# Altium schematic sheet Micro.SchDoc
size A
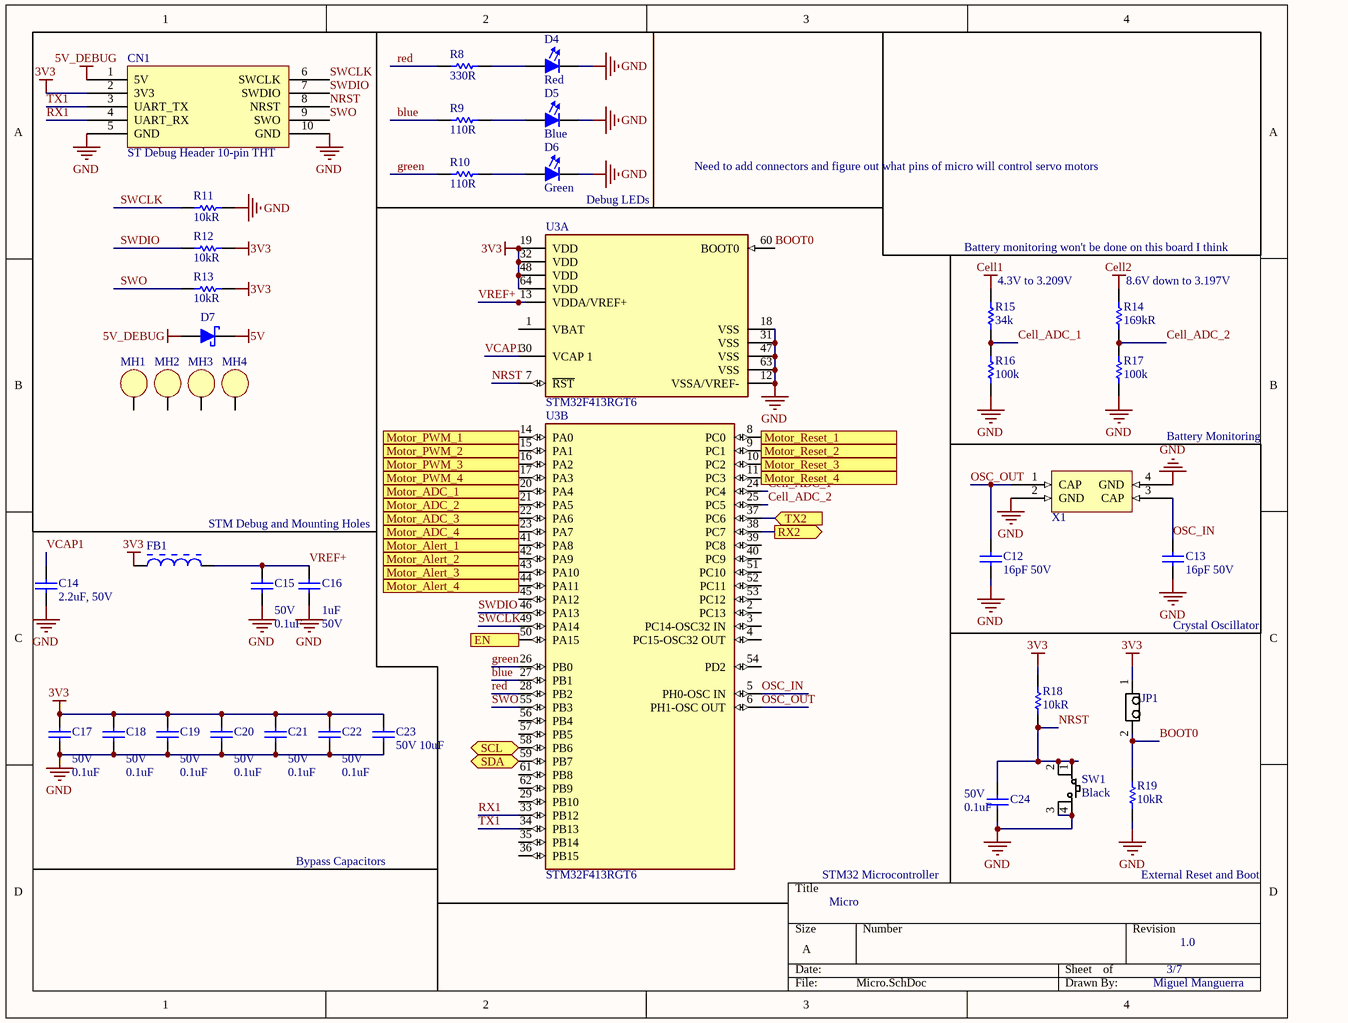
[diagram p0: Micro.SchDoc]

## Parts
C12  Voltage: 16pF 50V  [CAPC1608X90X35ML10T15]  (hidden comment: 16pF Ceramic 50V 5% 0603)
C13  Voltage: 16pF 50V  [CAPC1608X90X35ML10T15]  (hidden comment: 16pF Ceramic 50V 5% 0603)
C14  2.2uF, 50V  [CAPC1608N(0603")]
C15  Voltage: 50V  Capacitance: 0.1uF  [FP-CL10-0_1-MFG]  (hidden comment: CL10B104JB8NNNC)
C16  Capacitance: 1uF  Voltage: 50V  [0803 CAP]  (hidden comment: CL21B105KBFNNNG)
C17  Voltage: 50V  Capacitance: 0.1uF  [FP-CL10-0_1-MFG]  (hidden comment: CL10B104JB8NNNC)
C18  Voltage: 50V  Capacitance: 0.1uF  [FP-CL10-0_1-MFG]  (hidden comment: CL10B104JB8NNNC)
C19  Voltage: 50V  Capacitance: 0.1uF  [FP-CL10-0_1-MFG]  (hidden comment: CL10B104JB8NNNC)
C20  Voltage: 50V  Capacitance: 0.1uF  [FP-CL10-0_1-MFG]  (hidden comment: CL10B104JB8NNNC)
C21  Voltage: 50V  Capacitance: 0.1uF  [FP-CL10-0_1-MFG]  (hidden comment: CL10B104JB8NNNC)
C22  Voltage: 50V  Capacitance: 0.1uF  [FP-CL10-0_1-MFG]  (hidden comment: CL10B104JB8NNNC)
C23  50V 10uF  [CAPC3216X180X50LL20T30]
C24  Voltage: 50V  Capacitance: 0.1uF  [FP-CL10-0_1-MFG]  (hidden comment: CL10B104JB8NNNC)
CN1  ST Debug Header 10-pin THT  [10-pin shrouded header THT]
D4  Red  [FP-LB_Q39E-MFG]
D5  Blue  [FP-LB_Q39E-MFG]
D6  Green  [FP-LB_Q39E-MFG]
D7  CUS08F30,H3F  [SC-76]  (value not drawn)
FB1  BLM18AG601SN1D  [MURA-BLM18-F-H1-CHIP-2_V]  (value not drawn)
JP1  1x2 Male Header  [2X1 Males Header]  (value not drawn)
MH1  Mount_Hole_3mm  [Mount-Hole_3mm]  (value not drawn)
MH2  Mount_Hole_3mm  [Mount-Hole_3mm]  (value not drawn)
MH3  Mount_Hole_3mm  [Mount-Hole_3mm]  (value not drawn)
MH4  Mount_Hole_3mm  [Mount-Hole_3mm]  (value not drawn)
R8  Resistance: 330R  [FP-CRCW0603-e3-IPC_C]  (hidden comment: CRCW0603330RFKEA)
R9  Resistance: 110R  [RESC1608X55X25ML10T15]  (hidden comment: RC0603FR-07110RL)
R10  Resistance: 110R  [RESC1608X55X25ML10T15]  (hidden comment: RC0603FR-07110RL)
R11  10kR  [RESC1608N(0603")]
R12  10kR  [RESC1608N(0603")]
R13  10kR  [RESC1608N(0603")]
R14  Resistance: 169kR  [RESC0603(1608)_M]  (hidden comment: 169kR, 1%, 1/10W, 0603)
R15  Resistance: 34k  [RESC1608N(0603")]  (hidden comment: 34kR, 1%, 1/10W, 0603)
R16  value 100k  [RESC1608N(0603")]  (hidden comment: 100kR, 1%, 1/10W, 0603 SMD)
R17  value 100k  [RESC1608N(0603")]  (hidden comment: 100kR, 1%, 1/10W, 0603 SMD)
R18  10kR  [RESC1608N(0603")]
R19  10kR  [RESC1608N(0603")]
SW1  Button Colour: Black  [4-SPST-NO]  (hidden comment: PTS645SL43SMTR92LFS)
U3  STM32F413RGT6  [FP-LQFP64-5W-MFG]  (parts A,B of 2)
X1  CRYSTAL 8.0MHZ 16PF SMD  [QFN250P750X520X140_HS-5M]  (value not drawn)

## Blocks framed on the sheet
STM Debug and Mounting Holes: CN1 D7 MH1-MH4 R11-R13
Debug LEDs: D4-D6 R8-R10

## Ports
EN (out), Motor_ADC_1 (in), Motor_ADC_2 (in), Motor_ADC_3 (in), Motor_ADC_4 (in), Motor_Alert_1 (in), Motor_Alert_2 (in), Motor_Alert_3 (in), Motor_Alert_4 (in), Motor_PWM_1 (out), Motor_PWM_2 (out), Motor_PWM_3 (out), Motor_PWM_4 (out), Motor_Reset_1, Motor_Reset_2, Motor_Reset_3, Motor_Reset_4, RX2 (out), SCL (bidir), SDA (bidir), TX2 (in)

## Nets
3V3: C17.1 C18.1 C19.1 C20.1 C21.1 C22.1 C23.1 CN1.2(3V3) FB1.1 JP1.1 R12.1 R13.1 R18.1 U3.19(VDD) U3.32(VDD) U3.48(VDD) U3.64(VDD)
5V: D7.K(Cathode)
5V_DEBUG: CN1.1(5V) D7.A(Anode)
Cell1: R15.2
Cell2: R14.2
GND: C12.1 C13.1 C14.2(Cathode) C15.2 C16.2 C17.2 C18.2 C19.2 C20.2 C21.2 C22.2 C23.2 C24.2 CN1.5(GND) CN1.10(GND) D4.1(Cathode) D5.1(Cathode) D6.1(Cathode) R11.1 R16.1 R17.1 R19.2 SW1.3 SW1.4 U3.12(VSSA/VREF-) U3.18(VSS) U3.31(VSS) U3.47(VSS) U3.63(VSS) X1.2(GND) X1.4(GND)
blue: R9.1 U3.27(PB1)
BOOT0: JP1.2 R19.1 U3.60(BOOT0)
Cell_ADC_1: R15.1 R16.2 U3.24(PC4)
Cell_ADC_2: R14.1 R17.2 U3.25(PC5)
EN: U3.50(PA15) ; port EN
green: R10.1 U3.26(PB0)
Motor_ADC_1: U3.20(PA4) ; port Motor_ADC_1
Motor_ADC_2: U3.21(PA5) ; port Motor_ADC_2
Motor_ADC_3: U3.22(PA6) ; port Motor_ADC_3
Motor_ADC_4: U3.23(PA7) ; port Motor_ADC_4
Motor_Alert_1: U3.41(PA8) ; port Motor_Alert_1
Motor_Alert_2: U3.42(PA9) ; port Motor_Alert_2
Motor_Alert_3: U3.43(PA10) ; port Motor_Alert_3
Motor_Alert_4: U3.44(PA11) ; port Motor_Alert_4
Motor_PWM_1: U3.14(PA0) ; port Motor_PWM_1
Motor_PWM_2: U3.15(PA1) ; port Motor_PWM_2
Motor_PWM_3: U3.16(PA2) ; port Motor_PWM_3
Motor_PWM_4: U3.17(PA3) ; port Motor_PWM_4
Motor_Reset_1: U3.8(PC0) ; port Motor_Reset_1
Motor_Reset_2: U3.9(PC1) ; port Motor_Reset_2
Motor_Reset_3: U3.10(PC2) ; port Motor_Reset_3
Motor_Reset_4: U3.11(PC3) ; port Motor_Reset_4
NRST: C24.1 CN1.8(NRST) R18.2 SW1.1 SW1.2 U3.7(~{RST})
OSC_IN: C13.2 U3.5(PH0-OSC_IN) X1.3(CAP)
OSC_OUT: C12.2 U3.6(PH1-OSC_OUT) X1.1(CAP)
red: R8.1 U3.28(PB2)
RX1: CN1.4(UART_RX) U3.33(PB12)
RX2: U3.38(PC7) ; port RX2
SCL: U3.58(PB6) ; port SCL
SDA: U3.59(PB7) ; port SDA
SWCLK: CN1.6(SWCLK) R11.2 U3.49(PA14)
SWDIO: CN1.7(SWDIO) R12.2 U3.46(PA13)
SWO: CN1.9(SWO) R13.2 U3.55(PB3)
TX1: CN1.3(UART_TX) U3.34(PB13)
TX2: U3.37(PC6) ; port TX2
VCAP1: C14.1(Anode) U3.30(VCAP_1)
VREF+: C15.1 C16.1 FB1.2 U3.13(VDDA/VREF+)
NetD4_2: D4.2(Anode) R8.2
NetD5_2: D5.2(Anode) R9.2
NetD6_2: D6.2(Anode) R10.2

Not connected (* = marked no-connect by the designer): MH1 1; MH2 1; MH3 1; MH4 1; U3 1(VBAT) 2(PC13) 3(PC14-OSC32_IN) 4(PC15-OSC32_OUT) 29(PB10) 35(PB14) 36(PB15) 39(PC8) 40(PC9) 45(PA12) 51(PC10) 52(PC11) 53(PC12) 54(PD2) 56(PB4) 57(PB5) 61(PB8) 62(PB9)

## Notes on the sheet
- Need to add connectors and figure out what pins of micro will control servo motors
- Battery monitoring won't be done on this board I think
- (near R15) 4.3V to 3.209V
- (near R14) 8.6V down to 3.197V
- Battery Monitoring
- Crystal Oscillator
- Bypass Capacitors
- STM32 Microcontroller
- Micro
- External Reset and Boot
- 3/7
- 1.0
- Miguel Manguerra

## Library data of the parts
C12 C13 = CMP-00087-2: Cap Ceramic 16pF 50V C0G 5% SMD 0603 125C Paper T/R; Temperature Coefficient: 30ppm/°C; Termination: SMD/SMT; Voltage Rating: 50V; Dielectric: C0G; Radiation Hardening: No; Voltage Rating (DC): 50V; Max Operating Temperature: 125°C; Height: 0.8mm; Width: 0.8mm; Length: 1.6mm; Package Quantity: 1; Lead Free: Lead Free; Min Operating Temperature: -55°C; Case Code (Metric): 1608; Case/Package: 0603; Tolerance: 5%; Mount: Surface Mount; Capacitance: 16pF; Thickness: 0.035inch; Case Code (Imperial): 0603; Depth: 0.8mm; Packaging: Tape and Reel
C14 = CMP-006-0030-1: Capacitor, Ceramic, 50V, 10%, 0603 SMD, X5R; Value: 2.2µF; Date Created: *; Design Item ID: 2.2uF, 50V, 0603 SMD, X5R, Ceramic; Made By: *; Publisher: AUVic; Source: AUVic_Schematic_Library_Capacitors.SchLib; Pin Count: 2; PackageDescription: Chip Capacitor; Component Type: Standard
C15 C17-C22 C24 = CMP-00000-3: CAP CER 0.1UF 50V X7R 0603; Tolerance: 5%; Material: Ceramic; Case Code (Imperial): 0603; Mount: Surface Mount; Thickness: 0.035inch; Depth: 0.8mm; Packaging: Tape and Reel; Package Quantity: 1; Dielectric: X7R; Height: 0.8mm; Radiation Hardening: No; Max Operating Temperature: 125°C; Voltage Rating: 50V; Case/Package: 0603; Min Operating Temperature: -55°C; Case Code (Metric): 1608; Length: 1.6mm; Contact Plating: Tin; Width: 0.031inch
C16 = CMP-00005-1: SAMSUNG ELECTRO-MECHANICS - CL21B105KBFNNNG - MLCC CAPACITORS; Tolerance: 10%; Material: Ceramic; Dielectric: X7R; Case/Package: 0805; Voltage Rating: 50V; Contact Plating: Tin; Max Operating Temperature: 125°C; Termination: Wraparound; Package Quantity: 3000; Depth: 1.25mm; Mount: Surface Mount; Min Operating Temperature: -55°C; Thickness: 0.053inch; Packaging: Tape and Reel; Case Code (Metric): 2012; Length: 2mm; Case Code (Imperial): 0805; Width: 0.049inch
C23 = CMP-00004-1: Cap Ceramic 10uF 50V X7R 10% Pad SMD 1206 125°C T/R; Thickness: 0.071inch; Case/Package: 1206; Case Code (Metric): 3216; Case Code (Imperial): 1206; Voltage Rating: 50V; Length: 0.126inch; Max Operating Temperature: 125°C; Voltage Rating (DC): 50V; Capacitance: 10uF; Dielectric: X7R; Lead Free: Lead Free; Min Operating Temperature: -55°C; Tolerance: 10%; Mount: Surface Mount; Packaging: Tape and Reel; Width: 0.063inch
CN1 = CMP-00011-6: CONN HEADER VERT 10POS 2.54MM; Row Spacing: 0.1inch; Connector Type: Male Pin; Number of Positions: 10; Packaging: Tray; Package Quantity: 1; Color: Black; Number of Rows: 2; Termination: Solder; Contact Plating: Gold; Lead Free: Lead Free; Pitch: 0.1inch; Mount: Through Hole
D4 = CMP-00066-2: LED Red 645nm 2-Pin Chip 0603(1608Metric) T/R; Lens Transparency: Diffused; Power Dissipation: 65mW; Forward Voltage: 2.5V; Dominant Wavelength: 633nm; Number of Elements: 1; Lens Style: Diffused,Flat,Colorless,Rectangular; Lens Color: White; Viewing Angle: 160°; Luminous Flux: 0.33lm; Test Current: 20mA; Forward Current: 25mA; Luminous Intensity: 180mcd; Reverse Voltage: 12V; Lens Size: 0.8mm; Max Operating Temperature: 85°C; Depth: 0.9mm; Illumination Color: Red; Color: Red; Packaging: Tape and Reel; Min Operating Temperature: -30°C; Case Code (Imperial): 0603; Case Code (Metric): 1608; Number of Pins: 2; Mount: Surface Mount; Height: 0.8mm; Package Quantity: 1; Length: 1.7mm; Width: 0.8mm; Number of LEDs: 1; Case/Package: 0603; Radiation Hardening: No
D5 = CMP-00063-3: LED BLUE DIFFUSED 0603 SMD; Luminous Flux: 0.13lm; Lens Size: 0.8mm; Lens Color: White; Viewing Angle: 130°; Luminous Intensity: 42mcd; Number of LEDs: 1; Dominant Wavelength: 470nm; Lens Style: Flat,Diffused,Colorless,Rectangular; Test Current: 5mA; Forward Voltage: 2.85V; Packaging: Tape and Reel; Case/Package: 0603; Height: 0.4mm; Number of Pins: 2; Mount: Surface Mount; Case Code (Metric): 1608; Case Code (Imperial): 0603; Lens Transparency: Diffused; Width: 0.8mm; Length: 1.6mm; Color: Blue; Radiation Hardening: No
D6 = CMP-00064-3: LED GREEN DIFFUSED 0603 SMD; Dominant Wavelength: 530nm; Luminous Intensity: 280mcd; Lens Style: Diffused,Colorless,Rectangular; Number of LEDs: 1; Forward Voltage: 2.85V; Test Current: 5mA; Reverse Voltage: 5V; Forward Current: 15mA; Luminous Flux: 0.55lm; Radiation Hardening: No; Packaging: Tape and Reel; Mount: Surface Mount; Color: Green; Max Operating Temperature: 85°C; Number of Elements: 1; Number of Pins: 2; Min Operating Temperature: -40°C; Depth: 0.9mm; Case/Package: SMD/SMT; Length: 1.7mm
D7 = CMP-057-0000-2: Diode Schottky 30V 800mA Surface Mount USC; Peak Non-Repetitive Surge Current: 5A; Element Configuration: Single; Peak Reverse Current: 50uA; Packaging: Tape and Reel; Mount: Surface Mount; Average Rectified Current: 800mA; Case/Package: SOD; Max Reverse Voltage (DC): 30V; Min Operating Temperature: -55°C; Contact Plating: Tin,Silver; Max Repetitive Reverse Voltage (Vrrm): 30V; Number of Pins: 2; Max Operating Temperature: 125°C
FB1 = CMP-00016-1: MURATA - BLM18AG601SN1D - Feritový Korálek, 0603 / 1608, 600 ohm, 500 mA, Série BLM18A, 0.38 ohm, ± 25%; DC Current: 500mA; Impedance: 600R; DC Resistance (DCR): 380mR; Core Material: Ferrite; Shielding: Unshielded; Number of Lines: 1; Test Frequency: 100MHz; Material: Steel,Ferrite; Height: 0.8mm; Depth: 0.8mm; Min Operating Temperature: -55°C; Packaging: Tape and Reel; Weight: 7.1E-05oz; Width: 0.8mm; Military Standard: Not; Max Operating Temperature: 125°C; Max Current Rating: 500mA; Case Code (Metric): 1608; Length: 1.6mm; Case Code (Imperial): 0603; Package Quantity: 1; Max DC Current: 500mA; REACH SVHC: No SVHC; Termination: SMD/SMT; Current Rating: 500mA; Lead Free: Lead Free; Tolerance: 25%; Case/Package: 0603; Number of Pins: 2; Radiation Hardening: No; Frequency: 100MHz; Number of Circuits: 1
JP1 = CMP-004-0001-1: Made By: Andy Bates; Source: AUVic_Schematic_Library_Connectors.SchLib; Pin Count: 2; Design Item ID: 1x2 Male Header; Component Type: Standard
MH1-MH4 = CMP-004-0010-4: Mounting hold for M3 hex standoff; Source: AUVic_Schematic_Library_Connectors.SchLib; Design Item ID: Mount_Hole_3mm; Component Type: Standard; Pin Count: 1
R8 = CMP-00067-2: Res Thick Film 0603 330 Ohm 1% 0.1W(1/10W) +/-100ppm/ßC Pad SMD Automotive T/R; Voltage Rating (DC): 75V; Power Rating: 100mW; Temperature Coefficient: 100ppm/°C; Contact Plating: Tin; Package Quantity: 10; Tolerance: 1%; Packaging: Tape and Reel; Case/Package: 0603; Max Operating Temperature: 155°C; Case Code (Metric): 1608; Case Code (Imperial): 0603; Min Operating Temperature: -55°C; Length: 1.55mm; Height: 0.45mm; Lead Free: Lead Free; Termination: SMD/SMT; Voltage Rating: 75V; Composition: Thick Film; Weight: 7.1E-05oz; Military Standard: Not; Max Power Dissipation: 100mW; REACH SVHC: Unknown; Mount: Surface Mount; Depth: 0.85mm; Features: Automotive AEC-Q200; Number of Terminations: 2; Radiation Hardening: No; Width: 0.033inch
R9 R10 = CMP-00069-1: RES SMD 110 OHM 1% 1/10W 0603; Max Power Dissipation: 100mW; Voltage Rating (DC): 50V; Temperature Coefficient: 100ppm/°C; Working Voltage: 75V; Military Standard: Not; Termination: SMD/SMT; Number of Terminations: 2; Features: Moisture Resistant; Min Operating Temperature: -55°C; Power Rating: 100mW; Height: 0.022inch; Package Quantity: 1; Lead Free: Lead Free; Tolerance: 1%; Voltage Rating: 50V; Composition: Thick Film; Case Code (Imperial): 0603; Length: 1.6mm; Packaging: Tape and Reel; Case Code (Metric): 1608; Max Operating Temperature: 155°C; Depth: 0.8mm; Case/Package: 0603; Width: 0.031inch
R11-R13 R18 R19 = CMP-047-0013-1: 10kR, 1%, 1/10W, 0603 SMD; Owned By: AUVic; Made By: Ashwin Sira; Value: 10k; Design Item ID: 10kR; Pin Count: 2; Component Type: Standard; Created On: 14-05-31; Last Edited: 14-05-31; Source: AUVic_Schematic_Library_Resistors.SchLib
R14 = CMP-00096-2: RES 169K OHM 1% 1/10W 0603; Power Rating: 100mW; Temperature Coefficient: 100ppm/°C; Width: 0.031inch; Length: 0.061inch; Number of Terminations: 2; Radiation Hardening: No; Case Code (Metric): 1608; Height: 0.022inch; Tolerance: 1%; Case/Package: 0603; Features: Automotive AEC-Q200; Contact Plating: Tin,Matte; Packaging: Tape and Reel; Max Power Dissipation: 100mW; Max Operating Temperature: 155°C; Mount: Surface Mount; Case Code (Imperial): 0603; Lead Free: Lead Free; Resistor Type: Thick Film; Min Operating Temperature: -55°C
R15 = CMP-047-0046-1: RES 34K OHM 1/10W 1% 0603 SMD; Manufacturer Part Number: RC0603FR-0734KL; Manufacturer: Yageo; Temperature Coefficient: ±100ppm/°C; Power (Watts): 0.1W, 1/10W; ComponentLink1Description: http://www.yageo.com/documents/recent/PYu-RC0603_51_RoHS_L_4.pdf; Features: Moisture Resistant; Operating Temperature: -55°C ~ 155°C; Size / Dimension: 0.063" L x 0.031" W (1.60mm x 0.80mm); Category: Resistors; Package / Case: 0603 (1608 Metric); Height: 0.022" (0.55mm); Composition: Thick Film; Packaging: Cut Tape (CT); Component Type: Standard; Supplier Device Package: 0603; Pricing 1: 1=0.1, 10=0.015, 25=0.0108, 100=0.006, 250=0.00456, 500=0.00364, 1000=0.00268, 2500=0.00233 (USD); Pin Count: 2; Design Item ID: 34kR, 1%, 1/10W, 0603; Source: AUVic_Schematic_Library_Resistors.SchLib; RoHS: RoHS Compliant; Stock 1: 192; Number of Terminations: 2; ComponentLink1URL: http://www.yageo.com/documents/recent/PYu-RC0603_51_RoHS_L_4.pdf; Tolerance: ±1%
R16 R17 = CMP-047-0010-1: Made By: Andy Bates; Owned By: AUVic; Component Type: Standard; Pin Count: 2; Design Item ID: 100kR, 1%, 1/10W, 0603 SMD; Source: AUVic_Schematic_Library_Resistors.SchLib; Last Edited: 14-06-30; Created On: 14-06-30
SW1 = CMP-00077-1: Black Switch Tactile N.O. SPST Round Button Gull Wing 0.05A 12VDC 100000Cycles 1.27N SMD T/R; Actuator Material: Nylon,Polyamide; Switch Function: Off-Mom; Actuator Type: Standard; Illumination Type: Non-Illuminated; Max Voltage Rating (DC): 12V; Current Rating: 50mA; Actuator Length: 0.85mm; Contact Resistance: 100mR; Depth: 9mm; Length: 6mm; Termination: Gull Wing; Max Operating Temperature: 60°C; Mechanical Life: 100000Cycles; Packaging: Tape and Reel; Color: Black; Throw Configuration: SPST; Min Operating Temperature: -20°C; Mount: Surface Mount; Lead Free: Lead Free; Operating Force: 1.27N; Contact Material: Bronze,Brass,Silver; Max Current Rating: 50mA; Package Quantity: 1000; Voltage Rating (DC): 12V; Contact Plating: Silver; Orientation: Straight
U3 = CMP-00006-1: STMICROELECTRONICS - STM32F413RGT6 - MCU, ARM CORTEX-M4, 100MHZ, LQFP-64; Number of I/Os: 50; Oscillator Type: Internal; Peripherals: Brown-out Detect/Reset,POR,PWM,WDT,DMA,LCD; Interface: I2C,SPI,USB,IrDA,MMC,SDIO,UART,USART; Memory Type: FLASH; Memory Size: 1MB; Case/Package: LQFP; Packaging: Tray; Core Architecture: ARM; Min Operating Temperature: -40°C; Max Operating Temperature: 85°C; Frequency: 100MHz
X1 = CMP-00079-2: 8MHz ±30ppm Crystal 16pF 80 Ohms 4-SMD, No Lead; ESR (Equivalent Series Resistance): 80R; Frequency Stability: 50ppm; Min Operating Temperature: -20°C; Load Capacitance: 16pF; Frequency: 8MHz; Length: 7.5mm; Number of Pins: 4; Case/Package: CSMD; Max Operating Temperature: 70°C; Depth: 5.2mm; Packaging: Tape and Reel